# EAGLE schematic audio-amplifier-PAM8302A (EAGLE 9.5.2)
COMPANY: ADAFRUIT INDUSTRIES; DRAWN: KTOWN; REV: A
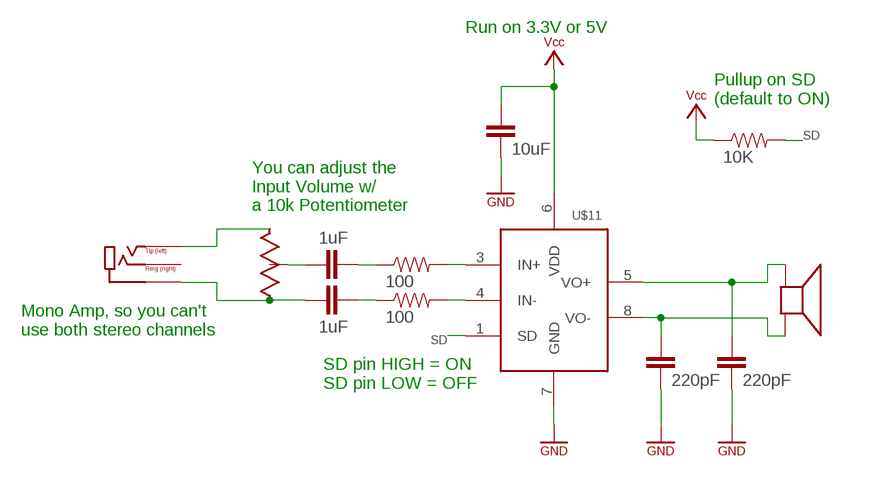
[diagram p0: schematic, sheet 1]

## Parts
C1  1uF  COMPONENT_CAP-0805  [0805]
C2  1uF  COMPONENT_CAP-0805  [0805]
C3  10uF  COMPONENT_CAP-0805  [0805]
C4  220pF  COMPONENT_CAP-0805  [0805]
C5  220pF  COMPONENT_CAP-0805  [0805]
R1  100  COMPONENT_RESISTOR-0805  [0805]
R2  100  COMPONENT_RESISTOR-0805  [0805]
R3  10K  COMPONENT_RESISTOR-0805  [0805]
SP1  MISC_SPEAKER/PS12  [SPEAKER_PS12]
U$1  CONN_AUDIO_HEADPHONE  [SJ2-35853A-SMT-TR]
U$10  10k  COMPONENT_POTENTIOMETER  [TC33X-2-103E]
U$11  IC_AUDIO_AMP_PAM8302A  [SOIC8]

## Nets
AIN-: C2.1 U$1.1(SLEEVE) U$10.3(B)
GND: C3.2 C4.2 C5.2 U$11.7(GND) ; supply symbol labelled SYMBOL_GND
N$1: R2.2 U$11.4(IN-)
N$2: R1.2 U$11.3(IN+)
N$3: C1.2 R1.1
N$4: C2.2 R2.1
N$5: U$1.2(TIP) U$10.1(A)
N$7: C1.1 U$10.2(WIPER)
SD: R3.2 U$11.1(SD)
VCC: C3.1 R3.1 U$11.6(VDD) ; supply symbol labelled SYMBOL_VCC
VO+: C5.1 SP1.P$1(+) U$11.5(VO+)
VO-: C4.1 SP1.P$2(-) U$11.8(VO-)
Unconnected: U$1.3(RING)

## Notes on the sheet
- Run on 3.3V or 5V
- Pullup on SD
  (default to ON)
- You can adjust the
  Input Volume w/
  a 10k Potentiometer
- Mono Amp, so you can't
  use both stereo channels
- SD pin HIGH = ON
  SD pin LOW = OFF

## Library data of the parts
C1-C5 = homemade-hardware:COMPONENT_CAP: Capacitor Standard 0603 ceramic capacitor, and 0.1" leaded capacitor.
R1-R3 = homemade-hardware:COMPONENT_RESISTOR
SP1 = homemade-hardware:MISC_SPEAKER: PS1240P02BT <https://www.digikey.com/product-detail/en/tdk-corporation/PS1240P02BT/445-2525-1-ND/935930>: Piezo Speaker DIP
U$1 = homemade-hardware:CONN_AUDIO_HEADPHONE: SJ2-35853A-SMT-TR <https://www.digikey.com/product-detail/en/cui-inc/SJ2-35853A-SMT-TR/CP-SJ2-35853A-SMT-DKR-ND/6619673>: 3.5mm Female Audio Conector - 3 Conductor - Horizontal SMD; PN: SJ2-35853A-SMT-TR
U$10 = homemade-hardware:COMPONENT_POTENTIOMETER: TC33X-2-103E <https://www.digikey.com/product-detail/en/bourns-inc/TC33X-2-103E/TC33X-103EDKR-ND/1785031>: 10K Potentiometer - 0.1W; PN: TC33X-2-103E
U$11 = homemade-hardware:IC_AUDIO_AMP_PAM8302A: PAM8302A <https://www.digikey.com/product-detail/en/diodes-incorporated/PAM8302AADCR/PAM8302AADCRDIDKR-ND/8546185>: Mono 2.5W Audio Amplifier; PN: PAM8302AADCR